# EAGLE design SmartCalendar_Mateusz.Kowalec (EAGLE 9.6.2)

## Sheet 1 of 2
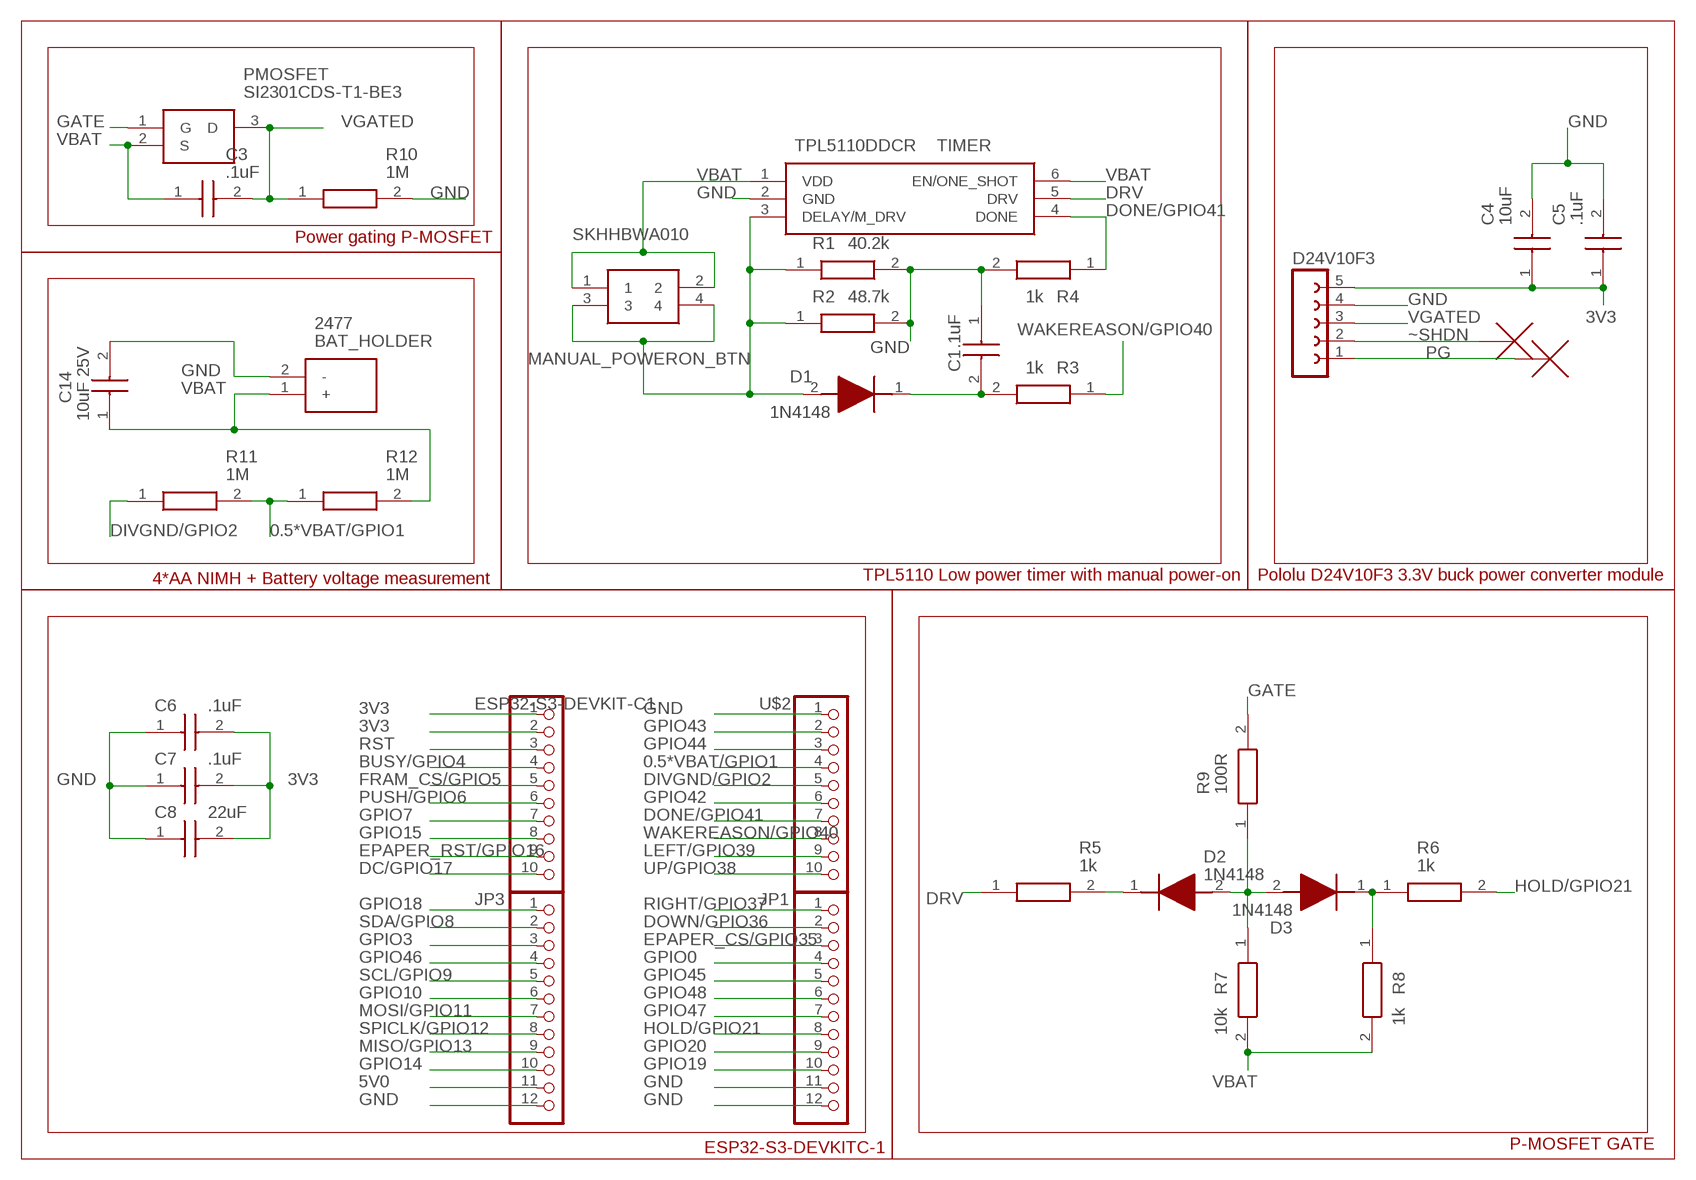
[diagram p0: schematic, sheet 1]

### Parts
BAT_HOLDER  2477  [2477]
C1  .1uF  0805ZC104JAZ2A  [CAPC2012X94N]
C3  .1uF  0805ZC104JAZ2A  [CAPC2012X94N]
C4  10uF  GCM21BR71A106KE22L  [CAPC2012X140N]
C5  .1uF  0805ZC104JAZ2A  [CAPC2012X94N]
C6  .1uF  0805ZC104JAZ2A  [CAPC2012X94N]
C7  .1uF  0805ZC104JAZ2A  [CAPC2012X94N]
C8  22uF  GRM31CR71A226KE15L  [GRM31X]
C14  10uF 25V  GCM21BC71E106KE36K  [GCM21]
D1  1N4148  [DIOAD1150W50L390D190]
D2  1N4148  [DIOAD1150W50L390D190]
D3  1N4148  [DIOAD1150W50L390D190]
D24V10F3  FE05-1  [FE05-1]
ESP32-S3-DEVKIT-C1  PINHD-1X10  [1X10-BIG]
JP1  PINHD-1X12-CB  [1X12-CB]
JP3  PINHD-1X12-CB  [1X12-CB]
MANUAL_POWERON_BTN  SKHHBWA010  [SKHHALA010]
PMOSFET  SI2301CDS-T1-BE3  [SOT95P237X112-3N]
R1  40.2k  CR0805-FX-4022ELF  [RESC2012X60N]
R2  48.7k  CR0805-FX-4872ELF  [RESC2012X60N]
R3  1k  CRCW08051K00FKTC  [RESC2012X50N]
R4  1k  CRCW08051K00FKTC  [RESC2012X50N]
R5  1k  CRCW08051K00FKTC  [RESC2012X50N]
R6  1k  CRCW08051K00FKTC  [RESC2012X50N]
R7  10k  RK73H2ATTE1002F  [RESC2012X60N]
R8  1k  CRCW08051K00FKTC  [RESC2012X50N]
R9  100R  CRCW0805100RFKEA  [RESC2012X50N]
R10  1M  MCU08050C1004FP500  [RESC2012X62N]
R11  1M  MCU08050C1004FP500  [RESC2012X62N]
R12  1M  MCU08050C1004FP500  [RESC2012X62N]
TIMER  TPL5110DDCR  [SOT95P280X110-6N]
U$2  PINHD-1X10  [1X10-BIG]
U$3  NC_MARKER  (no package)
U$4  NC_MARKER  (no package)

### Nets
0.5*VBAT/GPIO1: R11.2 R12.1 U$2.4
3V3: C4.1 C5.1 C6.2 C7.2 C8.2 D24V10F3.5 ESP32-S3-DEVKIT-C1.1 ESP32-S3-DEVKIT-C1.2 ; also sheet 2
5V0: JP3.11
BUSY/GPIO4: ESP32-S3-DEVKIT-C1.4 ; also sheet 2
DC/GPIO17: ESP32-S3-DEVKIT-C1.10 ; also sheet 2
DIVGND/GPIO2: R11.1 U$2.5
DONE/GPIO41: R4.1 TIMER.4(DONE) U$2.7
DOWN/GPIO36: JP1.2 ; also sheet 2
DRV: R5.1 TIMER.5(DRV)
EPAPER_CS/GPIO35: JP1.3 ; also sheet 2
EPAPER_RST/GPIO16: ESP32-S3-DEVKIT-C1.9 ; also sheet 2
FRAM_CS/GPIO5: ESP32-S3-DEVKIT-C1.5 ; also sheet 2
G: D2.2(A) D3.2(A) R7.1 R9.1
GATE: PMOSFET.1(G) R9.2
GND: BAT_HOLDER.2(-) C1.1 C4.2 C5.2 C6.1 C7.1 C8.1 C14.2 D24V10F3.4 JP1.11 JP1.12 JP3.12 R1.2 R2.2 R4.2 R10.2 TIMER.2(GND) U$2.1 ; also sheet 2
GPIO0: JP1.4
GPIO3: JP3.3
GPIO7: ESP32-S3-DEVKIT-C1.7
GPIO10: JP3.6
GPIO14: JP3.10
GPIO15: ESP32-S3-DEVKIT-C1.8
GPIO18: JP3.1
GPIO19: JP1.10
GPIO20: JP1.9
GPIO42: U$2.6
GPIO43: U$2.2
GPIO44: U$2.3
GPIO45: JP1.5
GPIO46: JP3.4
GPIO47: JP1.7
GPIO48: JP1.6
HOLD/GPIO21: JP1.8 R6.2
LEFT/GPIO39: U$2.9 ; also sheet 2
MAN_REXT: D1.2(A) MANUAL_POWERON_BTN.3 MANUAL_POWERON_BTN.4 R1.1 R2.1 TIMER.3(DELAY/M_DRV)
MISO/GPIO13: JP3.9 ; also sheet 2
MOSI/GPIO11: JP3.7 ; also sheet 2
N: D2.1(K) R5.2
N$1: C1.2 D1.1(K) R3.2
N$3: D3.1(K) R6.1 R8.1
PG: D24V10F3.1 U$4.P$1
PUSH/GPIO6: ESP32-S3-DEVKIT-C1.6 ; also sheet 2
RIGHT/GPIO37: JP1.1 ; also sheet 2
RST: ESP32-S3-DEVKIT-C1.3
SCL/GPIO9: JP3.5 ; also sheet 2
SDA/GPIO8: JP3.2 ; also sheet 2
SPICLK/GPIO12: JP3.8 ; also sheet 2
UP/GPIO38: U$2.10 ; also sheet 2
VBAT: BAT_HOLDER.1(+) C3.1 C14.1 MANUAL_POWERON_BTN.1 MANUAL_POWERON_BTN.2 PMOSFET.2(S) R7.2 R8.2 R12.2 TIMER.1(VDD) TIMER.6(EN/ONE_SHOT)
VGATED: C3.2 D24V10F3.3 PMOSFET.3(D) R10.1
WAKEREASON/GPIO40: R3.1 U$2.8
~SHDN: D24V10F3.2 U$3.P$1

### Notes on the sheet
- Power gating P-MOSFET
- 4*AA NIMH + Battery voltage measurement | TPL5110 Low power timer with manual power-on | Pololu D24V10F3 3.3V buck power converter module
- P-MOSFET GATE
- ESP32-S3-DEVKITC-1

## Sheet 2 of 2
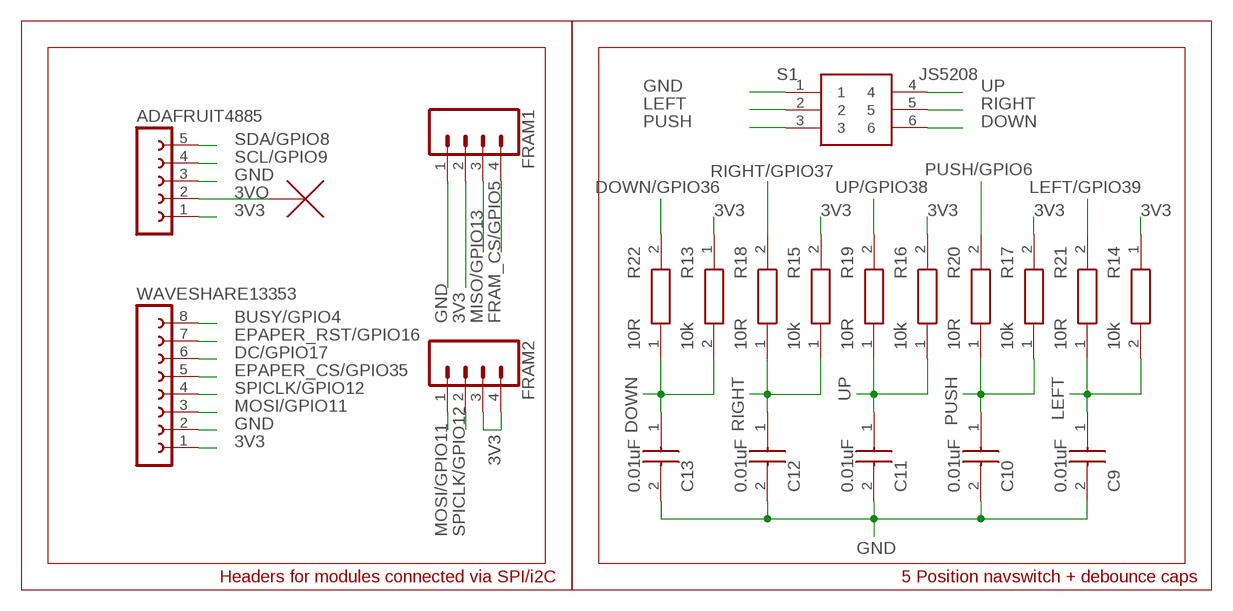
[diagram p1: schematic, sheet 2]

### Parts
ADAFRUIT4885  FE05-1  [FE05-1]
C9  0.01uF  0805ZC103KAT2A  [CAPC2012X94N]
C10  0.01uF  0805ZC103KAT2A  [CAPC2012X94N]
C11  0.01uF  0805ZC103KAT2A  [CAPC2012X94N]
C12  0.01uF  0805ZC103KAT2A  [CAPC2012X94N]
C13  0.01uF  0805ZC103KAT2A  [CAPC2012X94N]
FRAM1  CONN_04PTH  [1X04]
FRAM2  CONN_04PTH  [1X04]
R13  10k  RK73H2ATTE1002F  [RESC2012X60N]
R14  10k  RK73H2ATTE1002F  [RESC2012X60N]
R15  10k  RK73H2ATTE1002F  [RESC2012X60N]
R16  10k  RK73H2ATTE1002F  [RESC2012X60N]
R17  10k  RK73H2ATTE1002F  [RESC2012X60N]
R18  10R  CRCW0805100RFKEA  [RESC2012X50N]
R19  10R  CRCW0805100RFKEA  [RESC2012X50N]
R20  10R  CRCW0805100RFKEA  [RESC2012X50N]
R21  10R  CRCW0805100RFKEA  [RESC2012X50N]
R22  10R  CRCW0805100RFKEA  [RESC2012X50N]
S1  JS5208  [JS5208]
U$5  NC_MARKER  (no package)
WAVESHARE13353  FE08-1  [FE08]

### Nets
3V3: ADAFRUIT4885.1 FRAM1.2 FRAM2.3 FRAM2.4 R13.1 R14.1 R15.2 R16.2 R17.2 WAVESHARE13353.1 ; also sheet 1
3VO: ADAFRUIT4885.2 U$5.P$1
BUSY/GPIO4: WAVESHARE13353.8 ; also sheet 1
DC/GPIO17: WAVESHARE13353.6 ; also sheet 1
DOWN: C13.1(C1) R13.2 R22.1 S1.6
DOWN/GPIO36: R22.2 ; also sheet 1
EPAPER_CS/GPIO35: WAVESHARE13353.5 ; also sheet 1
EPAPER_RST/GPIO16: WAVESHARE13353.7 ; also sheet 1
FRAM_CS/GPIO5: FRAM1.4 ; also sheet 1
GND: ADAFRUIT4885.3 C9.2(C2) C10.2(C2) C11.2(C2) C12.2(C2) C13.2(C2) FRAM1.1 S1.1 WAVESHARE13353.2 ; also sheet 1
LEFT: C9.1(C1) R14.2 R21.1 S1.2
LEFT/GPIO39: R21.2 ; also sheet 1
MISO/GPIO13: FRAM1.3 ; also sheet 1
MOSI/GPIO11: FRAM2.1 WAVESHARE13353.3 ; also sheet 1
PUSH: C10.1(C1) R17.1 R20.1 S1.3
PUSH/GPIO6: R20.2 ; also sheet 1
RIGHT: C12.1(C1) R15.1 R18.1 S1.5
RIGHT/GPIO37: R18.2 ; also sheet 1
SCL/GPIO9: ADAFRUIT4885.4 ; also sheet 1
SDA/GPIO8: ADAFRUIT4885.5 ; also sheet 1
SPICLK/GPIO12: FRAM2.2 WAVESHARE13353.4 ; also sheet 1
UP: C11.1(C1) R16.1 R19.1 S1.4
UP/GPIO38: R19.2 ; also sheet 1

### Notes on the sheet
- Headers for modules connected via SPI/i2C | 5 Position navswitch + debounce caps

## Library data of the parts
ADAFRUIT4885 D24V10F3 = Library_Mateusz.Kowalec:FE05-1: FEMALE HEADER; OC_FARNELL: unknown; OC_NEWARK: unknown
BAT_HOLDER = Library_Mateusz.Kowalec:2477: Cylindrical Battery Contacts, Clips, Holders & Springs 4AA PLASTIC HOLDER Source: Datasheet <https://www.keyelco.com/product-pdf.cfm?p=1039>; DESCRIPTION: Cylindrical Battery Contacts, Clips, Holders & Springs 4AA PLASTIC HOLDER; HEIGHT: 17.01mm; MANUFACTURER_NAME: Keystone Electronics; MANUFACTURER_PART_NUMBER: 2477; MOUSER_PART_NUMBER: 534-2477; MOUSER_PRICE-STOCK: https://www.mouser.co.uk/ProductDetail/Keystone-Electronics/2477?qs=Q3RoVmURDolEbXnNenQutg%3D%3D
C1 C3 C5-C7 = Library_Mateusz.Kowalec:0805ZC104JAZ2A: Multilayer Ceramic Capacitors MLCC - SMD/SMT 10V .1uF X7R 0805 5% Tol FLEX Source: Datasheet; DESCRIPTION: Multilayer Ceramic Capacitors MLCC - SMD/SMT 10V .1uF X7R 0805 5% Tol FLEX; HEIGHT: 0.94mm; MANUFACTURER_NAME: Kyocera AVX; MANUFACTURER_PART_NUMBER: 0805ZC104JAZ2A; MOUSER_PART_NUMBER: 581-0805ZC104JAZ2A; MOUSER_PRICE-STOCK: https://www.mouser.co.uk/ProductDetail/KYOCERA-AVX/0805ZC104JAZ2A?qs=B1dT2wSxCVEnqW2OJfnNkg%3D%3D
C4 = Library_Mateusz.Kowalec:GCM21BR71A106KE22L: Murata GCM21BR71A106KE22L 10uF Multilayer Ceramic Capacitor MLCC 10V dc +/-10% Tolerance SMD Source: Datasheet <https://search.murata.co.jp/Ceramy/image/img/A01X/G101/ENG/GCM21BR71A106KE22-01A.pdf>; DESCRIPTION: Murata GCM21BR71A106KE22L 10uF Multilayer Ceramic Capacitor MLCC 10V dc +/-10% Tolerance SMD; HEIGHT: 1.4mm; MANUFACTURER_NAME: Murata Electronics; MANUFACTURER_PART_NUMBER: GCM21BR71A106KE22L; MOUSER_PART_NUMBER: 81-GCM21BR71A106KE2L; MOUSER_PRICE-STOCK: https://www.mouser.co.uk/ProductDetail/Murata-Electronics/GCM21BR71A106KE22L?qs=VsBYvjgrAjY%252BTrJ8Zxz5Dg%3D%3D
C8 = Library_Mateusz.Kowalec:GRM31CR71A226KE15L: MLCC, 1206 Source: Datasheet <https://search.murata.co.jp/Ceramy/image/img/A01X/G101/ENG/GRM31CR71A226KE15-01CA.pdf>; DESCRIPTION: MLCC, 1206; HEIGHT: 1.25mm; MANUFACTURER_NAME: Murata Electronics; MANUFACTURER_PART_NUMBER: GRM31CR71A226KE15L; MOUSER_PART_NUMBER: 81-GRM31CR71A226K15L; MOUSER_PRICE-STOCK: https://www.mouser.co.uk/ProductDetail/Murata-Electronics/GRM31CR71A226KE15L?qs=%2FBLjsTEvPnhfnPGA5Hlk4g%3D%3D
C9-C13 = Library_Mateusz.Kowalec:0805ZC103KAT2A: Capacitor 0805 10000PF +/-10% 10V Source: Datasheet <https://componentsearchengine.com/Datasheets/1/0805ZC103KAT2A.pdf>; DESCRIPTION: Capacitor 0805 10000PF +/-10% 10V; HEIGHT: mm; MANUFACTURER_NAME: Kyocera AVX; MANUFACTURER_PART_NUMBER: 0805ZC103KAT2A; MOUSER_PART_NUMBER: 581-0805ZC103KAT2A; MOUSER_PRICE-STOCK: https://www.mouser.com/Search/Refine.aspx?Keyword=581-0805ZC103KAT2A
C14 = Library_Mateusz.Kowalec:GCM21BC71E106KE36K: Chip Multilayer Ceramic Capacitors for Automotive (Powertrain/Safety), 1.6 x 0.8 (0603) Source: Datasheet <https://search.murata.co.jp/Ceramy/image/img/A01X/G101/ENG/GCM21BC71E106KE36-01A.pdf>; DESCRIPTION: Chip Multilayer Ceramic Capacitors for Automotive (Powertrain/Safety), 1.6 x 0.8 (0603); HEIGHT: 1.4mm; MANUFACTURER_NAME: Murata Electronics; MANUFACTURER_PART_NUMBER: GCM21BC71E106KE36K; MOUSER_PART_NUMBER: 81-GCM21B71E106KE36K; MOUSER_PRICE-STOCK: https://www.mouser.co.uk/ProductDetail/Murata-Electronics/GCM21BC71E106KE36K?qs=By6Nw2ByBD3dg3yZS4KZOA%3D%3D
D1-D3 = Library_Mateusz.Kowalec:1N4148: Diodes - General Purpose, Power, Switching Small Signal Diode, DO-35, 100V, 0.2A, 175C Source: Datasheet <https://diotec.com/request/datasheet/1n4148.pdf>; DESCRIPTION: Diodes - General Purpose, Power, Switching Small Signal Diode, DO-35, 100V, 0.2A, 175C; HEIGHT: mm; MANUFACTURER_NAME: Diotec; MANUFACTURER_PART_NUMBER: 1N4148; MOUSER_PART_NUMBER: 637-1N4148; MOUSER_PRICE-STOCK: https://www.mouser.co.uk/ProductDetail/Diotec-Semiconductor/1N4148?qs=OlC7AqGiEDmWf1%2FPHy84oA%3D%3D
ESP32-S3-DEVKIT-C1 U$2 = Library_Mateusz.Kowalec:PINHD-1X10: Pin header 1x10 0.1" spacing With round pins
FRAM1 FRAM2 = Library_Mateusz.Kowalec:CONN_04: Multi connection point. Often used as Generic Header-pin footprint for 0.1 inch spaced/style header connections On any of the 0.1 inch spaced packages, you can populate with these: Break Away Headers - Straight <https://www.sparkfun.com/products/116> (PRT-00116) Break Away Male Headers - Right Angle <https://www.sparkfun.com/products/553> (PRT-00553) Female Headers <https://www.sparkfun.com/products/115> (PRT-00115) Break Away Headers - Machine Pin <https://www.sparkfun.com/products/117> (PRT-00117) Break Away Female Headers - Swiss Machine Pin <https://www.sparkfun.com/products/743> (PRT-00743) For SCREWTERMINALS and SPRING TERMINALS visit here: Screw Terimnals on SparkFun.com <https://www.sparkfun.com/search/results?term=Screw+Terminals> (5mm/3.5mm/2.54mm spacing) This device is also useful as a general connection point to wire up your design to another part of your project. Our various solder wires solder well into these plated through hole pads. Hook-Up Wire - Assortment (Stranded, 22 AWG) <https://www.sparkfun.com/products/11375> (PRT-11375) Hook-Up Wire - Assortment (Solid Core, 22 AWG) <https://www.sparkfun.com/products/11367> (PRT-11367) View the entire wire category on our website here <https://www.sparkfun.com/categories/141> Special notes: Molex polarized connector foot print use with SKU : PRT-08231 with associated crimp pins and housings. 1MM SMD Version SKU: PRT-10208; PROD_ID: CONN-09696
JP1 JP3 = Library_Mateusz.Kowalec:PINHD-1X12: PIN HEADER
MANUAL_POWERON_BTN = Library_Mateusz.Kowalec:SKHHBWA010: Tact switch,PCB,SPST,grey,1.57N op/force Grey Stem Tactile Switch, SPST-NO 50 mA 7mm Source: Datasheet; DESCRIPTION: Tact switch,PCB,SPST,grey,1.57N op/force Grey Stem Tactile Switch, SPST-NO 50 mA 7mm; HEIGHT: mm; MANUFACTURER_NAME: ALPS Electric; MANUFACTURER_PART_NUMBER: SKHHBWA010; MOUSER_PART_NUMBER: 688-SKHHBW; MOUSER_PRICE-STOCK: https://www.mouser.co.uk/ProductDetail/Alps-Alpine/SKHHBWA010?qs=fMKjfF2mFojdVA4ViPP%252BGg%3D%3D
PMOSFET = Library_Mateusz.Kowalec:SI2301CDS-T1-BE3: MOSFET P-CHANNEL 20-V (D-S) Source: Datasheet <https://www.arrow.com/en/products/si2301cds-t1-be3/vishay?region=nac>; DESCRIPTION: MOSFET P-CHANNEL 20-V (D-S); HEIGHT: 1.12mm; MANUFACTURER_NAME: Vishay; MANUFACTURER_PART_NUMBER: SI2301CDS-T1-BE3; MOUSER_PART_NUMBER: 78-SI2301CDS-T1-BE3; MOUSER_PRICE-STOCK: https://www.mouser.co.uk/ProductDetail/Vishay-Siliconix/SI2301CDS-T1-BE3?qs=CiayqK2gdcJNFARNd%252BC6jg%3D%3D
R1 = Library_Mateusz.Kowalec:CR0805-FX-4022ELF: Thick Film Resistors - SMD 40.2K 1% Source: Datasheet <https://www.bourns.com/pdfs/chpreztr.pdf>; DESCRIPTION: Thick Film Resistors - SMD 40.2K 1%; HEIGHT: 0.6mm; MANUFACTURER_NAME: Bourns; MANUFACTURER_PART_NUMBER: CR0805-FX-4022ELF; MOUSER_PART_NUMBER: 652-CR0805FX-4022ELF; MOUSER_PRICE-STOCK: https://www.mouser.co.uk/ProductDetail/Bourns/CR0805-FX-4022ELF?qs=TYKCbaKwe1CyApdNi%252BhM5Q%3D%3D
R2 = Library_Mateusz.Kowalec:CR0805-FX-4872ELF: Thick Film Resistors - SMD 48.7K 1% Source: Datasheet <https://componentsearchengine.com/Datasheets/1/CR0805-FX-4872ELF.pdf>; DESCRIPTION: Thick Film Resistors - SMD 48.7K 1%; HEIGHT: 0.6mm; MANUFACTURER_NAME: Bourns; MANUFACTURER_PART_NUMBER: CR0805-FX-4872ELF; MOUSER_PART_NUMBER: 652-CR0805FX-4872ELF; MOUSER_PRICE-STOCK: https://www.mouser.com/Search/Refine.aspx?Keyword=652-CR0805FX-4872ELF
R3-R6 R8 = Library_Mateusz.Kowalec:CRCW08051K00FKTC: VISHAY - CRCW08051K00FKTC - RES, THICK FILM, 1K, 1%, 0.125W, 0805 Source: Datasheet <http://www.vishay.com/docs/20035/dcrcwe3.pdf>; DESCRIPTION: VISHAY - CRCW08051K00FKTC - RES, THICK FILM, 1K, 1%, 0.125W, 0805; HEIGHT: 0.5mm; MANUFACTURER_NAME: Vishay; MANUFACTURER_PART_NUMBER: CRCW08051K00FKTC; MOUSER_PART_NUMBER: 71-CRCW08051K00FKTC; MOUSER_PRICE-STOCK: https://www.mouser.co.uk/ProductDetail/Vishay-Dale/CRCW08051K00FKTC?qs=7lMtFQ21GD%2FEWL84NNePCQ%3D%3D
R7 R13-R17 = Library_Mateusz.Kowalec:RK73H2ATTE1002F: Thick Film Resistors - SMD Thick Film Resistors SMD1/4watts10Kohms1% Source: Datasheet <http://www.koaspeer.com/catimages/Products/RK73H/RK73H.pdf>; DESCRIPTION: Thick Film Resistors - SMD Thick Film Resistors SMD1/4watts10Kohms1%; HEIGHT: 0.6mm; MANUFACTURER_NAME: KOA Speer; MANUFACTURER_PART_NUMBER: RK73H2ATTE1002F; MOUSER_PART_NUMBER: 660-RK73H2ATTE1002F; MOUSER_PRICE-STOCK: https://www.mouser.co.uk/ProductDetail/KOA-Speer/RK73H2ATTE1002F?qs=OIuxGTP%2FwFrG7Jvt06d5xQ%3D%3D
R9 R18-R22 = Library_Mateusz.Kowalec:CRCW0805100RFKEA: Vishay CRCW Series Thick Film Surface Mount Resistor 0805 Case 100?? ??1% 0.125W ??100ppm/??C Source: Datasheet <http://www.vishay.com/docs/20035/dcrcwe3.pdf>; DESCRIPTION: Vishay CRCW Series Thick Film Surface Mount Resistor 0805 Case 100?? ??1% 0.125W ??100ppm/??C; HEIGHT: 0.5mm; MANUFACTURER_NAME: Vishay; MANUFACTURER_PART_NUMBER: CRCW0805100RFKEA; MOUSER_PART_NUMBER: 71-CRCW0805-100-E3; MOUSER_PRICE-STOCK: https://www.mouser.co.uk/ProductDetail/Vishay-Dale/CRCW0805100RFKEA?qs=LOX6nxTstiYDPDKmuLyNLw%3D%3D
R10 R12 = Library_Mateusz.Kowalec:MCU08050C1004FP500: 1 MOhms +/-1% 0.2W, 1/5W Chip Resistor 0805 (2012 Metric) Anti-Sulfur Thin Film Source: Datasheet <https://www.vishay.com/docs/28700/mcx0x0xpre.pdf>; DESCRIPTION: 1 MOhms +/-1% 0.2W, 1/5W Chip Resistor 0805 (2012 Metric) Anti-Sulfur Thin Film; HEIGHT: 0.62mm; MANUFACTURER_NAME: Vishay; MANUFACTURER_PART_NUMBER: MCU08050C1004FP500; MOUSER_PART_NUMBER: 594-MCU08050C1004FP5; MOUSER_PRICE-STOCK: https://www.mouser.co.uk/ProductDetail/Vishay-Beyschlag/MCU08050C1004FP500?qs=AQAM1KSmsrmCtsprlYmgHg%3D%3D
R11 = Library_Mateusz.Kowalec:MCU08050C1004FP500: 1 MOhms +/-1% 0.2W, 1/5W Chip Resistor 0805 (2012 Metric) Anti-Sulfur Thin Film Source: Datasheet <https://www.vishay.com/docs/28700/mcx0x0xpre.pdf>; DESCRIPTION: 1 MOhms +/-1% 0.2W, 1/5W Chip Resistor 0805 (2012 Metric) Anti-Sulfur Thin Film; HEIGHT: 0.62mm; MANUFACTURER_NAME: Vishay; MANUFACTURER_PART_NUMBER: MCU08050C1004FP500; MOUSER_PART_NUMBER: 594-MCU08050C1004FP5; MOUSER_PRICE-STOCK: https://www.mouser.co.uk/ProductDetail/Vishay-Beyschlag/MCU08050C1004FP500?qs=AQAM1KSmsrmCtsprlYmgHg%3D%3D; SPICEPREFIX: R
S1 = Library_Mateusz.Kowalec:JS5208: NAVIGATION, Surface Mount Source: Datasheet <https://configured-product-images.s3.amazonaws.com/2D/specs/JS5208.pdf>; DESCRIPTION: NAVIGATION, Surface Mount; HEIGHT: 12.2mm; MANUFACTURER_NAME: E-Switch; MANUFACTURER_PART_NUMBER: JS5208; MOUSER_PART_NUMBER: 612-JS5208; MOUSER_PRICE-STOCK: https://www.mouser.co.uk/ProductDetail/E-Switch/JS5208?qs=f57gQzlyLiqOzqNCAUlPQg%3D%3D
TIMER = Library_Mateusz.Kowalec:TPL5110DDCR: Timers & Support Products Ultr LowPowrTimerMOS drivr MOSFET Powr Source: Datasheet <https://www.ti.com/lit/ds/symlink/tpl5110.pdf?ts=1591886006313&ref_url=https://www.ti.com/store/ti/en/p/product/?p=TPL5110DDCR>; DESCRIPTION: Timers & Support Products Ultr LowPowrTimerMOS drivr MOSFET Powr; HEIGHT: 1.1mm; MANUFACTURER_NAME: Texas Instruments; MANUFACTURER_PART_NUMBER: TPL5110DDCR; MOUSER_PART_NUMBER: 595-TPL5110DDCR; MOUSER_PRICE-STOCK: https://www.mouser.co.uk/ProductDetail/Texas-Instruments/TPL5110DDCR?qs=beZBGHSk9c0piUt1%2Ff2GSg%3D%3D
U$3 U$4 = Library_Mateusz.Kowalec:NC_MARKER
U$5 = NC_MARKER:NC_MARKER
WAVESHARE13353 = Library_Mateusz.Kowalec:FE08-1: FEMALE HEADER; OC_FARNELL: unknown; OC_NEWARK: unknown

## Board
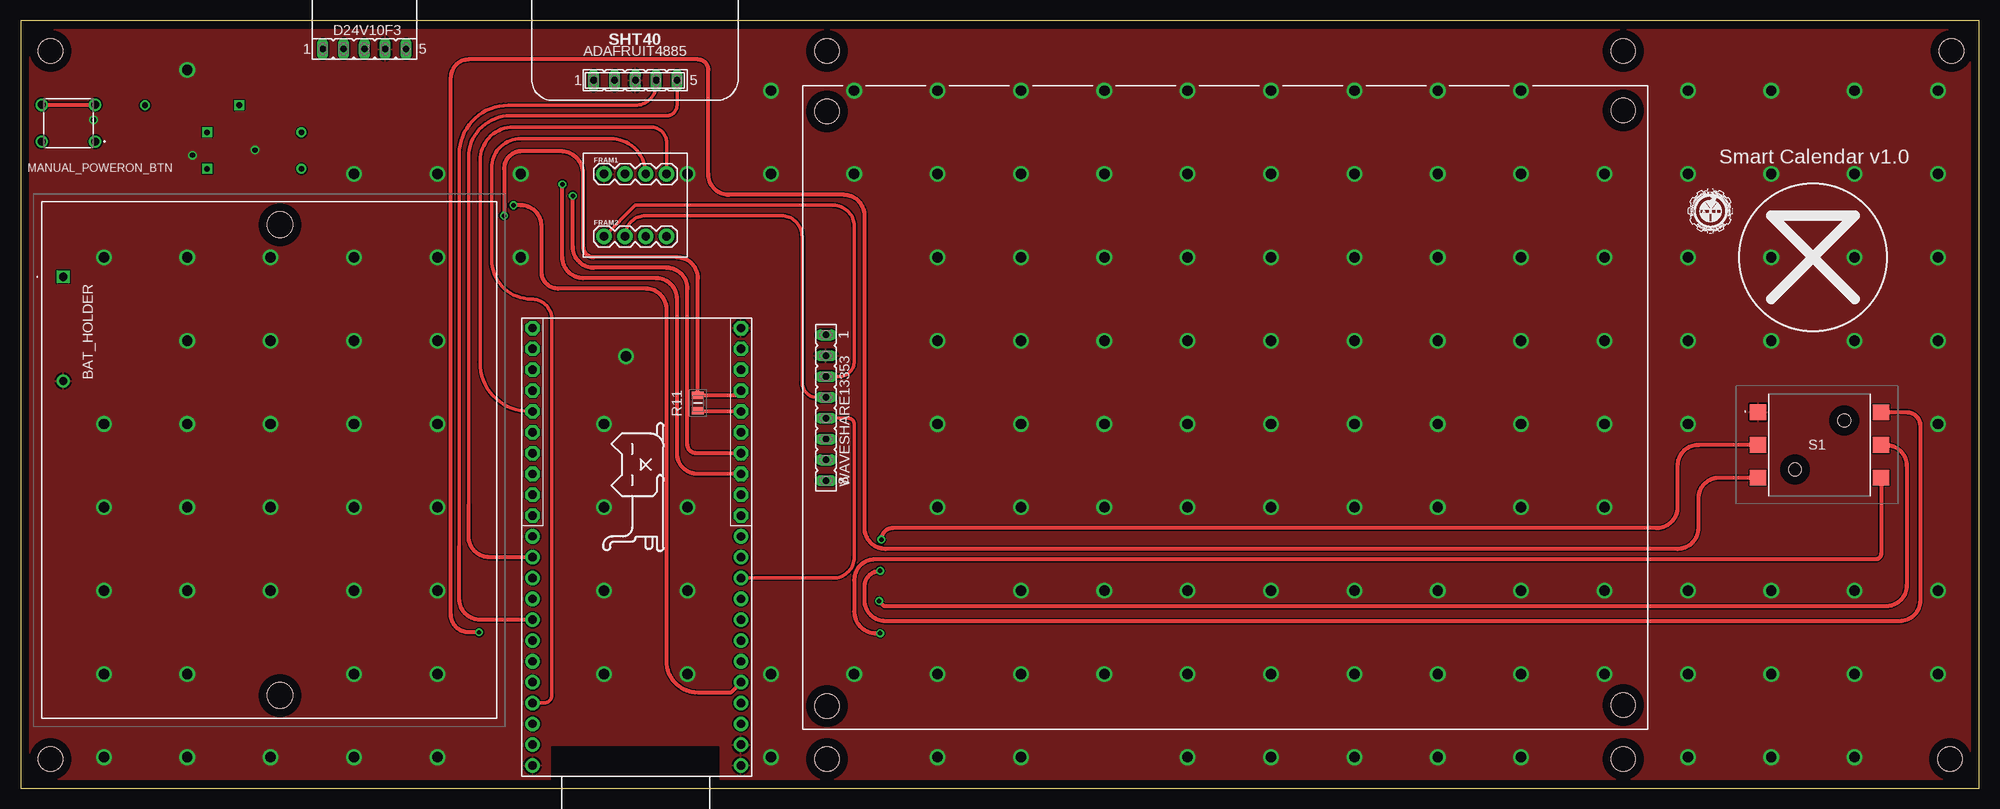
[diagram p2: board, top side]
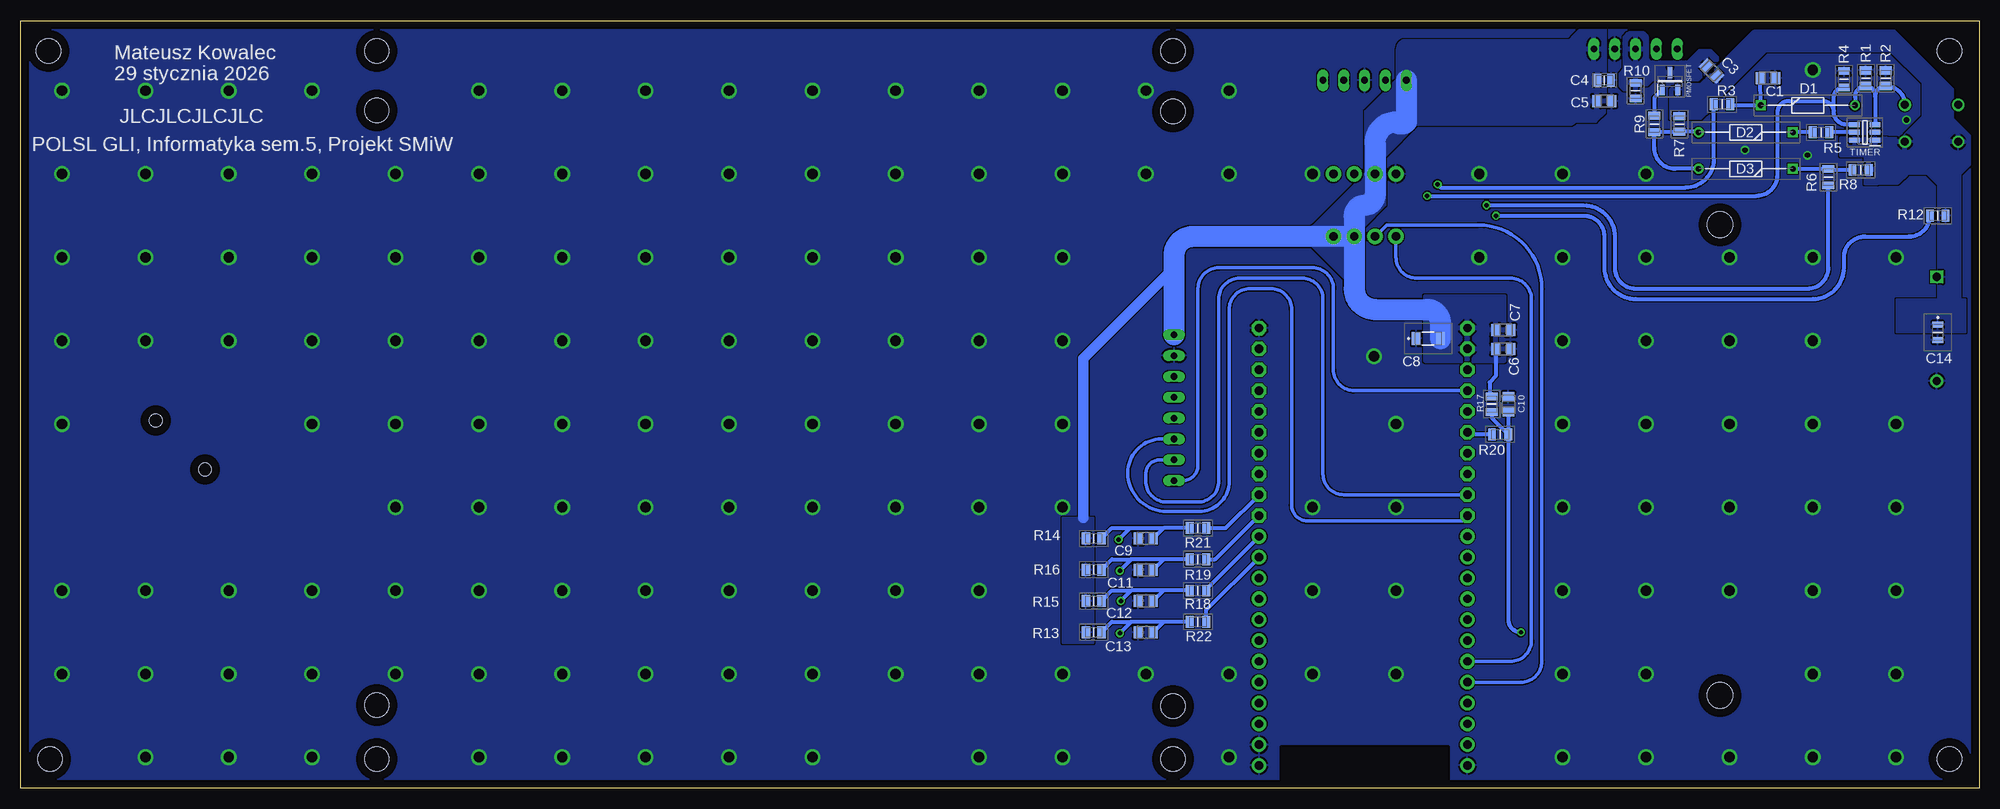
[diagram p3: board, bottom side, seen from below]

Size 238.74 x 93.65 mm. Coordinates in mm from the lower left corner, seen from the top.
Outline: 0,0 238.74,0 238.74,93.65 0,93.65 0,0
Copper layers (1*16): Top 0.035mm / dielectric 1.53mm / Bottom 0.035mm
Design rules "default *": minimum track width 6mil, minimum drill 0.3mm, track to track 6mil, track to pad 6mil, pad to pad 6mil, via to via 6mil, smd to smd 6mil, copper to edge 40mil, drill to drill 6mil, minimum pad ring 10mil, minimum via ring 8mil, stop-mask expansion 6mil, vias tented up to drill 0mil, thermal gap 10mil
Holes 3 mm at 195.33,10.16 98.3,10.03 98.3,82.55 195.33,82.68 195.33,89.95 98.3,89.95 235.33,89.95 195.33,3.58 235.14,3.58 98.3,3.58 3.66,89.95 3.66,3.58
tKeepout: area 64.8,0 to 85.1,5.1
bKeepout: area 64.8,0 to 85.1,5.1
tRestrict: area 64.8,0 to 85.1,5.1
bRestrict: area 64.8,0 to 85.1,5.1

### Footprints (pad centres in the part's own frame; a part is rotated, then mirrored left to right if it is on the bottom)
FE05-1 = drill 0.813 long: 1 -5.08,0; 2 -2.54,0; 3 0,0; 4 2.54,0; 5 5.08,0
2477 = drill 1.02 pad 1.53 square: 1 0,0 | drill 1.02 pad 1.53: 2 0,12.7 | hole 3.18: -26.42,-6.35; -26.42,51.05
CAPC2012X94N = smd 1.118 x 1.448: 1 -0.914,0; 2 0.914,0
CAPC2012X140N = smd 0.94 x 1.43: 1 -0.82,0; 2 0.82,0
GRM31X = smd 1.05 x 1.6: 1 -1.475,0; 2 1.475,0
GCM21 = smd 0.7 x 1.3: 1 -0.95,0; 2 0.95,0
DIOAD1150W50L390D190 = drill 0.7 pad 1.1 square: 1 0,0 | drill 0.7 pad 1.1: 2 11.5,0
1X10-BIG = drill 1.016 pad 1.778 octagon: 1 -11.43,0; 2 -8.89,0; 3 -6.35,0; 4 -3.81,0; 5 -1.27,0; 6 1.27,0; 7 3.81,0; 8 6.35,0; 9 8.89,0; 10 11.43,0
1X04 = drill 1.016 pad 1.88: 1 0,0; 2 2.54,0; 3 5.08,0; 4 7.62,0
1X12-CB = drill 1.016 pad 1.778: 1 -13.97,0; 2 -11.43,0; 3 -8.89,0; 4 -6.35,0; 5 -3.81,0; 6 -1.27,0; 7 1.27,0; 8 3.81,0; 9 6.35,0; 10 8.89,0; 11 11.43,0; 12 13.97,0
SKHHALA010 = drill 1 pad 1.5: 1 -3.25,2.25; 2 3.25,2.25; 3 -3.25,-2.25; 4 3.25,-2.25
SOT95P237X112-3N = smd 1.3 x 0.6: 1 -1.05,0.95; 2 -1.05,-0.95; 3 1.05,0
RESC2012X60N = smd 1 x 1.45: 1 -0.95,0; 2 0.95,0
RESC2012X50N = smd 0.95 x 1.45: 1 -1,0; 2 1,0
RESC2012X62N = smd 0.9 x 1.45: 1 -0.95,0; 2 0.95,0
JS5208 = smd 2 x 1.9: 1 -6.683,3.975; 2 -6.683,-0.025; 3 -6.683,-4.025; 4 8.317,3.975; 5 8.317,-0.025; 6 8.317,-4.025 | hole 1.6: 3.817,2.975; -2.183,-3.025
SOT95P280X110-6N = smd 1.25 x 0.6: 1 -1.25,0.95; 2 -1.25,0; 3 -1.25,-0.95; 4 1.25,-0.95; 5 1.25,0; 6 1.25,0.95
FE08 = drill 0.813 long: 1 -8.89,0; 2 -6.35,0; 3 -3.81,0; 4 -1.27,0; 5 1.27,0; 6 3.81,0; 7 6.35,0; 8 8.89,0

### Placement (x,y rotation side)
ADAFRUIT4885  74.93,86.36 0 top
BAT_HOLDER  5.21,62.39 180 top
C1  25.78,86.61 180 bottom
C3  32.64,87.5 135 bottom
C4  45.72,86.36 0 bottom
C5  45.72,83.82 0 bottom
C6  58.04,53.59 180 bottom
C7  58.04,55.88 180 bottom
C8  67.18,54.86 0 bottom
C9  101.6,30.48 180 bottom
C10  57.4,46.86 90 bottom
C11  101.6,26.67 180 bottom
C12  101.6,22.86 180 bottom
C13  101.6,19.05 180 bottom
C14  5.08,55.63 270 bottom
D1  26.67,83.31 0 bottom
D2  22.73,80.01 180 bottom
D3  22.73,75.56 180 bottom
D24V10F3  41.91,90.17 0 top
ESP32-S3-DEVKIT-C1  62.4,44.71 270 top
FRAM1  71.12,74.93 0 top
FRAM2  71.12,67.31 0 top
JP1  87.8,16.77 270 top
JP3  62.4,16.77 270 top
MANUAL_POWERON_BTN  5.84,81.12 180 top
PMOSFET  37.72,86.23 90 bottom
R1  13.84,86.61 90 bottom
R2  11.43,86.61 90 bottom
R3  31.37,83.44 0 bottom
R4  16.51,86.49 90 bottom
R5  19.3,80.01 180 bottom
R6  18.41,74.55 270 bottom
R7  36.58,81.03 90 bottom
R8  14.48,75.44 0 bottom
R9  39.62,81.03 90 bottom
R10  41.91,85.09 270 bottom
R11  82.55,46.99 90 top
R12  5.08,69.85 0 bottom
R13  107.95,19.05 0 bottom
R14  107.95,30.48 0 bottom
R15  107.95,22.86 180 bottom
R16  107.95,26.67 180 bottom
R17  59.44,46.86 90 bottom
R18  95.25,24.13 0 bottom
R19  95.25,27.94 0 bottom
R20  58.42,43.18 180 bottom
R21  95.25,31.75 0 bottom
R22  95.25,20.32 0 bottom
S1  218.44,41.91 0 top
TIMER  13.97,80.01 180 bottom
U$2  87.8,44.71 270 top
WAVESHARE13353  98.16,46.42 270 top

### Tracks (layer width: path | path; a pad name or v marks a point on that pad's centre or on a via)
0.5*VBAT/GPIO1  (via drill 0.55)
  Top 0.508: U$2.4 arc-90 87.23,47.94 R11.2 82.55,62.23 arc90 80.01,64.77 69.85,64.77 arc-90 68.58,66.04 68.58,74.93 arc90 65.79,77.72 61.09,77.72 arc90 58.93,75.56 v58.93,69.85
  Bottom 0.508: v58.93,69.85 48.26,69.85 arc90 45.72,67.31 45.72,63.5 arc-90 41.91,59.69 20.32,59.69 arc-90 16.51,63.5 16.51,64.77 arc90 13.97,67.31 8.57,67.31 arc-90 R12.1
3V3
  Bottom 0.508: C6.2 58.95,50.27 59.69,49.53 59.69,48.07 R17.2
  Bottom 1.27: 98.16,63.5 109.22,52.44 109.22,33.02
  Bottom 2.54: ADAFRUIT4885.1 69.85,81.28 arc90 71.12,81.28 arc-90 73.66,78.74 FRAM1.2 73.66,72.39 arc90 74.93,71.12 arc-90 76.2,69.85 FRAM2.3 | FRAM2.3 76.2,60.96 arc-90 73.66,58.42 67.31,58.42 arc90 65.71,56.82 C8.2 | FRAM2.3 FRAM2.4 95.87,67.31 arc-90 98.16,65.02 98.16,63.5 WAVESHARE13353.1
  pour Bottom: 45.72,92.71 45.72,82.55 46.86,81.41 50.8,81.41 50.8,90.17 48.26,92.71
  pour Bottom: 57.91,52.2 57.91,59.94 67.56,59.94 67.56,52.2 66.67,52.2
  pour Bottom: 50.16,82.04 69.85,82.04 69.85,90.17 50.16,90.17
  pour Bottom: 81.28,68.58 74.93,74.93 72.39,74.93 72.39,71.12 74.93,68.58 77.47,66.04 77.47,62.23 81.28,66.04
  pour Bottom: 69.85,87.63 74.93,82.55 74.93,75.06 72.77,75.06 72.77,76.71 67.94,81.53 67.94,85.72
  pour Bottom: 107.95,17.78 107.95,33.02 111.76,33.02 111.76,17.78
BUSY/GPIO4
  Bottom 0.432: ESP32-S3-DEVKIT-C1.4 76.2,48.52 arc90 78.74,51.06 78.74,60.96 arc-90 81.28,63.5 92.71,63.5 arc-90 95.25,60.96 95.25,39.37 arc90 97.09,37.53 WAVESHARE13353.8
DC/GPIO17
  Bottom 0.432: WAVESHARE13353.6 99.69,42.61 arc-90 103.79,38.52 arc-90 99.06,33.78 95.12,33.78 arc-90 91.44,37.47 91.44,58.42 arc90 88.9,60.96 86.36,60.96 arc90 83.82,58.42 83.82,34.55 arc-90 81.92,32.64 63.04,32.64 ESP32-S3-DEVKIT-C1.10
DIVGND/GPIO2
  Top 0.508: U$2.5 82.61,45.98 arc-90 R11.1
DONE/GPIO41  (via drill 0.55)
  Top 0.508: U$2.7 82.29,40.9 arc-90 81.28,41.91 81.28,60.96 arc90 78.74,63.5 69.85,63.5 arc-90 67.31,66.04 v67.31,72.26
  Bottom 0.508: TIMER.4 16.19,80.96 arc90 17.78,82.55 | 17.78,82.55 17.78,84.22 arc90 R4.1 | 17.78,82.55 arc-90 19.05,83.82 23.24,83.82 arc-90 24.64,82.42 24.64,74.8 arc90 27.18,72.26 v67.31,72.26
DOWN  (via drill 0.55)
  Top 0.508: S1.6 226.76,28.64 arc-90 226.06,27.94 104.14,27.94 arc90 101.6,25.4 101.6,21.59 arc90 104.27,18.92 v104.78,18.92
  Bottom 0.508: R22.1 99.42,20.32 | C13.1 99.42,20.32 | 99.42,20.32 103.38,20.32 | v104.78,18.92 103.38,20.32 | R13.2 105.73,20.32 103.38,20.32
DOWN/GPIO36
  Bottom 0.508: R22.2 94.25,21.75 JP1.2
DRV
  Bottom 0.508: TIMER.5 R5.1
EPAPER_CS/GPIO35
  Top 0.432: WAVESHARE13353.5 100.9,45.15 arc-90 101.6,44.45 101.6,28.2 arc-90 99.06,25.66 JP1.3
EPAPER_RST/GPIO16
  Bottom 0.432: WAVESHARE13353.7 99.88,40.07 arc-90 101.6,38.35 101.6,37.47 arc-90 99.06,34.92 95.25,34.92 arc-90 92.71,37.47 92.71,59.69 arc90 90.17,62.23 82.55,62.23 arc90 80.01,59.69 80.01,38.36 arc-90 77.47,35.82 ESP32-S3-DEVKIT-C1.9
FRAM_CS/GPIO5
  Top 0.432: FRAM1.4 78.74,78.74 arc90 76.83,80.64 60.07,80.64 arc90 56.01,76.58 56.01,51.94 arc90 61.97,45.98 ESP32-S3-DEVKIT-C1.5
G
  Bottom 0.508: D2.2 34.3,80.08 R7.1 36.63,80.03 R9.1 39.62,78.11 arc-90 37.08,75.56 D3.2
GATE
  Bottom 0.508: PMOSFET.1 39.62,84.23 R9.2
GND  (via drill 0.64, 1.27)
  Top 0.254: S1.1 211.59,45.72
  Top 1.27: S1.1 arc-90 211.59,45.72
  other vias: 10.16,13.97 20.32,13.97 10.16,3.81 20.32,3.81 81.28,13.97 81.28,24.13 81.28,34.29 91.44,13.97 101.6,13.97 111.76,13.97 111.76,3.81 91.44,3.81 101.6,74.93 101.6,85.09 142.24,54.61 142.24,64.77 121.92,13.97 132.08,13.97 30.48,54.61 40.64,54.61 30.48,44.45 40.64,44.45 10.16,34.29 20.32,34.29 10.16,24.13 20.32,24.13 30.48,34.29 40.64,34.29 30.48,24.13 40.64,24.13 50.8,24.13 50.8,34.29 50.8,44.45 50.8,54.61 71.12,44.45 71.12,34.29 71.12,24.13 71.12,13.97 73.79,52.7 60.96,74.93 81.28,74.93 91.44,74.93 91.44,85.09 20.32,54.61 10.16,44.45 20.32,44.45 20.32,64.77 10.16,64.77 20.95,77.22 28.57,77.85 30.48,64.77 40.64,74.93 40.64,64.77 50.8,64.77 50.8,74.93 111.76,74.93 111.76,85.09 121.92,74.93 121.92,85.09 132.08,74.93 132.08,85.09 142.24,74.93 142.24,85.09 152.4,74.93 152.4,85.09 162.56,74.93 162.56,85.09 172.72,74.93 172.72,85.09 182.88,74.93 182.88,85.09 152.4,54.61 152.4,64.77 162.56,54.61 162.56,64.77 121.92,54.61 121.92,64.77 111.76,54.61 111.76,64.77 132.08,54.61 132.08,64.77 203.2,74.93 203.2,85.09 40.64,13.97 30.48,3.81 40.64,3.81 50.8,13.97 50.8,3.81 121.92,3.81 8.89,81.53 20.32,87.63 60.96,64.77 142.24,13.97 142.24,3.81 152.4,3.81 152.4,13.97 111.76,44.45 121.92,44.45 132.08,44.45 142.24,44.45 152.4,44.45 162.56,44.45 111.76,34.29 121.92,34.29 132.08,34.29 142.24,34.29 152.4,34.29 162.56,34.29 121.92,24.13 132.08,24.13 142.24,24.13 152.4,24.13 162.56,24.13 162.56,13.97 162.56,3.81 172.72,3.81 172.72,13.97 182.88,13.97 182.88,3.81 193.04,13.97 203.2,13.97 203.2,3.81 213.36,13.97 213.36,3.81 223.52,3.81 223.52,13.97 233.68,13.97 172.72,64.77 172.72,54.61 172.72,44.45 172.72,34.29 172.72,24.13 182.88,24.13 193.04,24.13 203.2,24.13 213.36,24.13 223.52,24.13 233.68,24.13 182.88,34.29 193.04,34.29 182.88,44.45 193.04,44.45 182.88,54.61 193.04,54.61 182.88,64.77 193.04,64.77 193.04,74.93 203.2,64.77 203.2,54.61 203.2,44.45 213.36,85.09 213.36,74.93 213.36,64.77 213.36,54.61 223.52,85.09 223.52,74.93 233.68,85.09 233.68,74.93 223.52,64.77 233.68,64.77 223.52,54.61 233.68,54.61 233.68,44.45
  pour Bottom (rank 3): -9.74,-14.39 -9.74,109.22 261.62,109.22 251.46,99.06 251.46,-20.32 -3.81,-20.32
  pour Top: -15.24,-20.32 -15.24,120.65 -20.32,125.73 269.24,125.73 269.24,-8.89 255.27,-22.86 -12.7,-22.86
HOLD/GPIO21  (via drill 0.55)
  Top 0.508: JP1.8 86.53,11.69 82.55,11.69 arc-90 78.74,15.5 78.74,58.42 arc90 76.2,60.96 65.53,60.96 arc-90 63.5,62.99 63.5,68.58 arc90 60.96,71.12 v60.07,71.12
  Bottom 0.508: v60.07,71.12 48.26,71.12 arc90 44.45,67.31 44.45,63.5 arc-90 41.91,60.96 20.95,60.96 arc-90 18.41,63.5 R6.2
LEFT  (via drill 0.55)
  Top 0.508: S1.2 204.47,41.88 arc90 201.93,39.34 201.93,34.29 arc-90 199.39,31.75 106.3,31.75 arc90 v104.9,30.35
  Bottom 0.508: R21.1 99.42,31.75 | 99.42,31.75 C9.1 | 103.5,31.75 99.42,31.75 | v104.9,30.35 103.5,31.75 | R14.2 105.73,31.75 103.5,31.75
LEFT/GPIO39
  Bottom 0.508: R21.2 91.87,31.75 U$2.9
MAN_REXT
  Top 0.508: MANUAL_POWERON_BTN.4 MANUAL_POWERON_BTN.3
  Bottom 0.508: MANUAL_POWERON_BTN.3 arc-90 11.38,85.66 R2.1 arc-90 12.72,84.37 | D1.2 15.17,84.34 arc90 R1.1 arc90 12.72,84.54 12.72,84.37 | 12.72,84.37 TIMER.3
MISO/GPIO13
  Top 0.432: FRAM1.3 arc90 71.88,79.25 60.96,79.25 arc90 57.4,75.69 57.4,64.52 arc90 62.23,59.69 arc-90 64.77,57.15 64.77,11.43 arc-90 63.76,10.42 JP3.9
MOSI/GPIO11
  Top 0.432: WAVESHARE13353.3 99.76,50.23 arc90 101.6,52.07 101.6,68.58 arc90 99.06,71.12 74.93,71.12 FRAM2.1
  Bottom 0.432: JP3.7 57.15,15.5 arc-90 54.61,18.04 54.61,59.69 arc-90 57.15,62.23 68.58,62.23 arc90 71.12,64.77 FRAM2.1
N
  Bottom 0.508: R5.2 D2.1
N$1
  Bottom 0.508: R3.2 30.24,83.31 D1.1 C1.2
N$3
  Bottom 0.508: R8.1 18.3,75.44 R6.1 22.72,75.55 arc90 D3.1
PUSH  (via drill 0.51)
  Top 0.508: v55.88,19.05 54.61,19.05 arc-90 52.45,21.21 52.45,86.74 arc-90 54.61,88.9 82.55,88.9 arc-90 83.82,87.63 83.82,74.93 arc90 86.36,72.39 100.33,72.39 arc-90 102.87,69.85 102.87,31.75 arc90 105.41,29.21 201.93,29.21 arc90 204.47,31.75 204.47,35.34 arc-90 207.01,37.88 S1.3
  Bottom 0.508: C10.1 57.42,45.93 R20.1 | R17.1 59.44,45.2 R20.1 | R20.1 57.42,20.59 arc-90 v55.88,19.05
PUSH/GPIO6
  Bottom 0.508: R20.2 62.15,43.18 ESP32-S3-DEVKIT-C1.6
RIGHT  (via drill 0.55)
  Top 0.508: S1.5 227.33,41.88 arc-90 229.87,39.34 229.87,24.77 arc-90 227.33,22.23 105.28,22.23 v104.65,22.86
  Bottom 0.508: R18.1 99.42,24.13 | C12.1 99.42,24.13 | 99.42,24.13 103.38,24.13 | v104.65,22.86 103.38,24.13 | R15.1 105.73,24.13 103.38,24.13
RIGHT/GPIO37
  Bottom 0.508: R18.2 94.25,24.29 JP1.1
SCL/GPIO9
  Top 0.432: 53.47,29.52 53.47,77.34 arc-90 59.44,83.31 74.93,83.31 arc90 77.47,85.85 ADAFRUIT4885.4
  Top 0.508: JP3.5 56.01,20.58 arc-90 53.47,23.12 53.47,29.52
SDA/GPIO8
  Top 0.432: 54.61,34.55 54.61,76.96 arc-90 59.69,82.04 78.74,82.04 arc90 80.01,83.31 ADAFRUIT4885.5
  Top 0.508: JP3.2 57.15,28.2 arc-90 54.61,30.74 54.61,34.55
SPICLK/GPIO12
  Top 0.432: FRAM2.2 arc-90 76.2,69.85 92.71,69.85 arc-90 95.25,67.31 95.25,49.53 arc90 97.09,47.69 WAVESHARE13353.4
  Bottom 0.432: JP3.8 55.88,12.96 arc-90 53.34,15.5 53.34,60.96 arc-90 61.09,68.71 72.26,68.71 FRAM2.2
UP  (via drill 0.55)
  Top 0.508: S1.4 229.87,45.88 arc-90 231.52,44.23 231.52,22.94 arc-90 228.98,20.4 105.41,20.4 arc-90 102.87,22.94 102.87,24.64 arc-90 v104.78,26.54
  Bottom 0.508: R19.1 99.42,27.94 | C11.1 99.42,27.94 | 99.42,27.94 103.38,27.94 | v104.78,26.54 103.38,27.94 | R16.1 105.73,27.94 103.38,27.94
UP/GPIO38
  Bottom 0.508: R19.2 93.14,27.94 U$2.10
VBAT
  pour Bottom: 1.65,55.63 10.16,55.63 10.16,59.69 1.65,59.69
  pour Bottom: 5.08,59.69 5.08,73.66 6.35,74.93 8.89,74.93 9.91,75.95 9.91,79.12 9.78,79.12 6.86,82.04 3.56,82.04 0.64,79.12 0.64,76.58 2.29,74.93 2.29,57.4 2.54,57.15
  pour Bottom: 32.89,85.85 37.08,85.85 37.72,85.22 37.72,81.66 33.91,81.66 32.89,82.68
  pour Bottom: 7.87,78.87 6.73,80.01 6.73,86.11 10.67,90.04 26.16,90.04 34.04,82.17 34.04,85.6 27.3,92.33 10.54,92.33 3.43,85.22 3.43,80.39 1.91,78.87
  pour Bottom: 13.21,79.12 13.21,77.09 13.72,76.58 13.72,73.91 10.03,73.91 8.89,75.06 8.89,78.36 9.65,79.12
  pour Bottom: 11.3,79.25 16.89,79.25 16.89,77.72 16.89,77.22 13.21,77.22 11.3,77.22
  pour Bottom: 13.97,74.04 13.97,77.09 13.84,77.09 12.45,77.09 12.45,74.04 12.45,73.66 13.97,73.66
VGATED
  pour Bottom: 32,88.9 34.42,86.49 40.01,86.49 41.27,85.22 43.18,85.22 43.69,85.72 43.69,87.12 43.18,87.63 43.18,91.57 42.67,92.08 41.02,92.08 40.64,91.69 40.64,88.9 40.26,88.52 35.43,88.52 34.04,89.92 32.89,89.92 32,89.03
WAKEREASON/GPIO40  (via drill 0.55)
  Top 0.508: U$2.8 82.55,38.36 arc-90 80.01,40.9 80.01,59.69 arc90 77.47,62.23 68.58,62.23 arc-90 66.04,64.77 v66.04,73.66
  Bottom 0.508: v66.04,73.66 65.66,73.28 35.81,73.28 arc-90 32.38,76.71 32.38,83.42 arc90 R3.1

### Text on the board
tPlace: SHT40
tNames: Smart Calendar v1.0
bNames: Mateusz Kowalec | 29 stycznia 2026 | JLCJLCJLCJLC | POLSL GLI, Informatyka sem.5, Projekt SMiW